# Altium project Reflex_InterfaceBoard_RevF_201603.PrjPcb
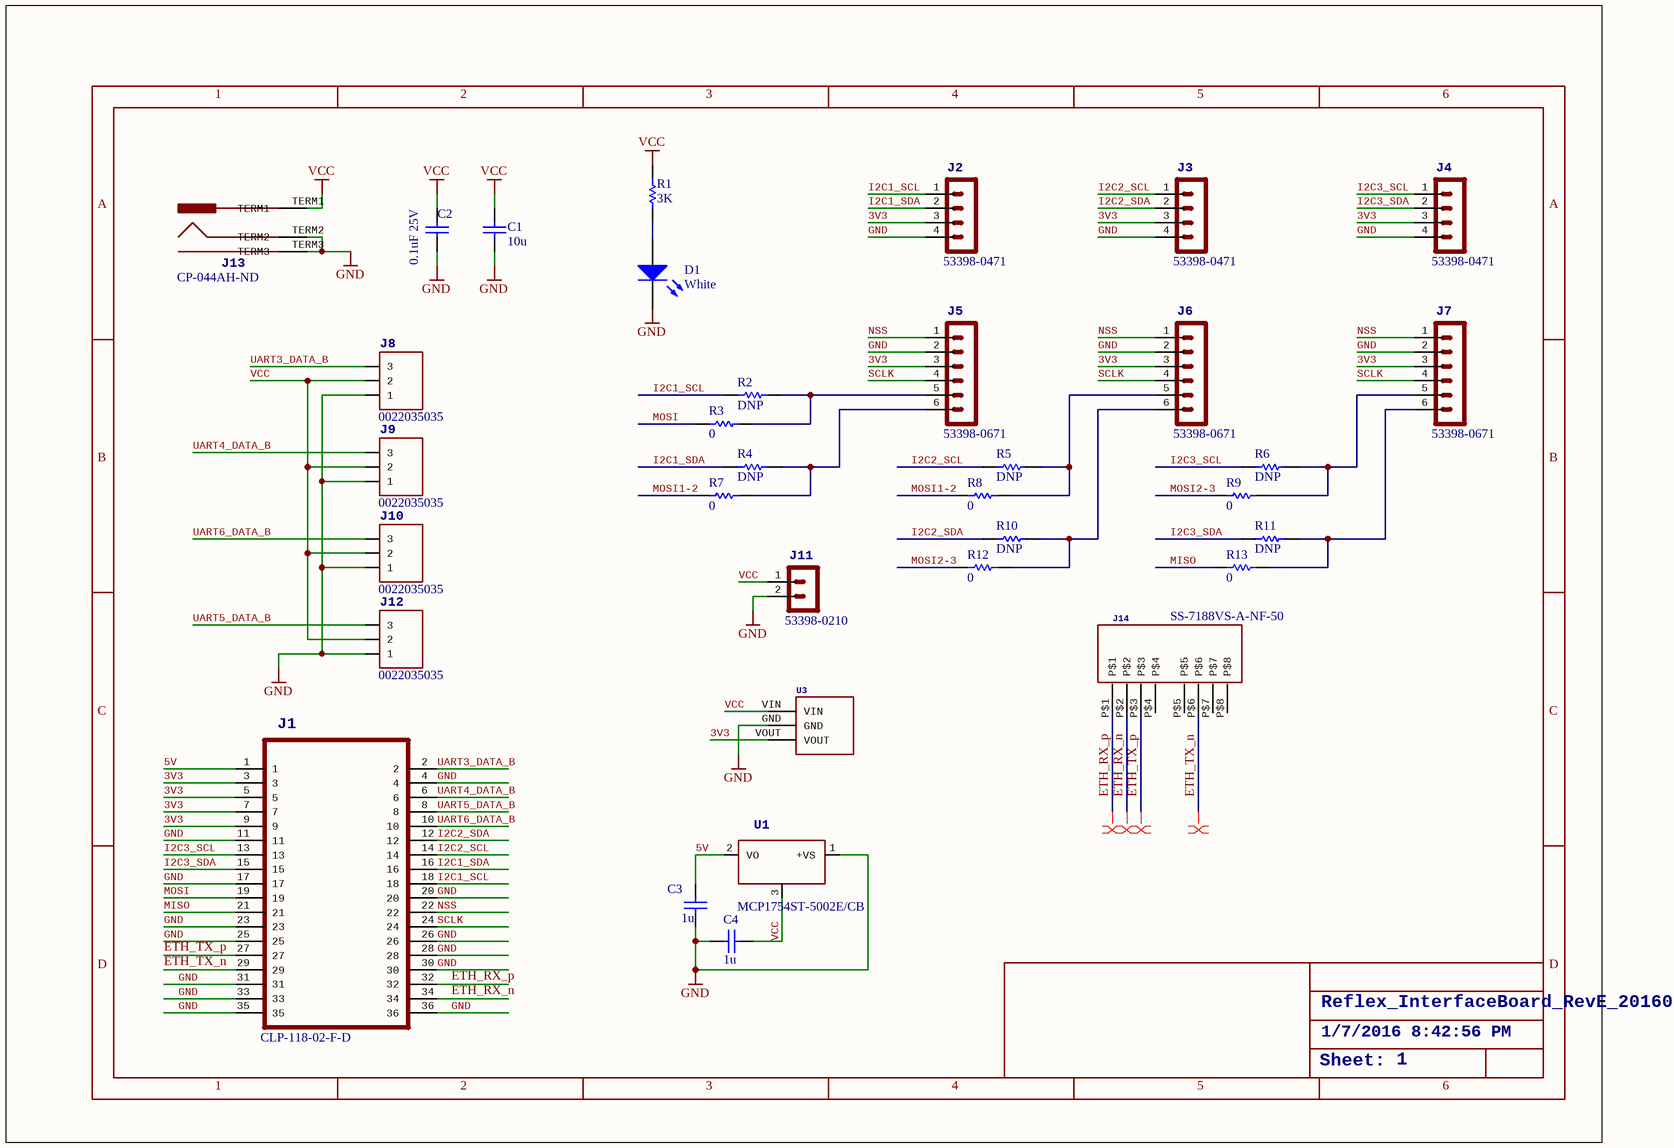
[diagram p0: Reflex_InterfaceBoard_RevF_201603.SchDoc]
1 sheet, 34 parts. Net scope: global (net labels, ports and power ports of the same name join across sheets).
Board files: Reflex_InterfaceBoard_RevF_201603.PcbDoc, ReflexInterfaceAndBrainRevF.PcbDoc

## Sheet Reflex_InterfaceBoard_RevF_201603.SchDoc: Reflex_InterfaceBoard_RevE_201601
size 282 x 200 mm; Date: 1/7/2016 8:42:56 PM; SheetNumber: 1

### Parts
C1  value 10u  [GENERIC_0603]  (hidden comment: Cap_0603_10uF)
C2  0.1uF 25V  [Generic_0603]
C3  1u  [Generic_0603]
C4  1u  [Generic_0603]
D1  value White  [0402_LED_WHITE]  (hidden comment: LED White)
J1  CLP-118-02-F-D  [SAMTEC_CLP-118-02-F-D]
J2  53398-0471  [53398-0410]
J3  53398-0471  [53398-0410]
J4  53398-0471  [53398-0410]
J5  53398-0671  [53398-0610]
J6  53398-0671  [53398-0610]
J7  53398-0671  [53398-0610]
J8  0022035035  [0022035035]
J9  0022035035  [0022035035]
J10  0022035035  [0022035035]
J11  53398-0210  [53398-0210]
J12  0022035035  [0022035035]
J13  value CP-044AH-ND  [BRLJCK(DK:CP-044AH-ND)]  (hidden comment: BRLJCK(DK:CP-044AH-ND))
J14  value SS-7188VS-A-NF-50  [STEWART-CONNECTOR-SS-7188VS-A-NF-50]
R1  3K  [Generic_0402]
R2  value DNP  [Generic_0402]  (hidden comment: Res_0402_DNP)
R3  value 0  [0402]  (hidden comment: Res_0402_0)
R4  value DNP  [Generic_0402]  (hidden comment: Res_0402_DNP)
R5  value DNP  [Generic_0402]  (hidden comment: Res_0402_DNP)
R6  value DNP  [Generic_0402]  (hidden comment: Res_0402_DNP)
R7  value 0  [0402]  (hidden comment: Res_0402_0)
R8  value 0  [0402]  (hidden comment: Res_0402_0)
R9  value 0  [0402]  (hidden comment: Res_0402_0)
R10  value DNP  [Generic_0402]  (hidden comment: Res_0402_DNP)
R11  value DNP  [Generic_0402]  (hidden comment: Res_0402_DNP)
R12  value 0  [0402]  (hidden comment: Res_0402_0)
R13  value 0  [0402]  (hidden comment: Res_0402_0)
U1  MCP1754ST-5002E/CB  [SOT-23]
U3  945-1394-5-ND(DIGIKEY)  [945-1394-5-ND(DIGIKEY)]  (value not drawn)

### Nets
GND: C1.1 C2.1 C3.1 C4.2 D1.2(K) J1.4 J1.11 J1.17 J1.20 J1.23 J1.25 J1.26 J1.28 J1.30 J1.31 J1.33 J1.35 J1.36 J2.4 J3.4 J4.4 J5.2 J6.2 J7.2 J8.3(1) J9.3(1) J10.3(1) J11.2 J12.3(1) J13.TERM2 J13.TERM3 U1.1(+VS) U3.GND
VCC: C1.2 C2.2 C4.1 J8.2 J9.2 J10.2 J11.1 J12.2 J13.TERM1 R1.2 U1.3(GND) U3.VIN
3V3: J1.3 J1.5 J1.7 J1.9 J2.3 J3.3 J4.3 J5.3 J6.3 J7.3 U3.VOUT
5V: C3.2 J1.1 U1.2(VO)
ETH_RX_n: J1.34 J14.P$2
ETH_RX_p: J1.32 J14.P$1
ETH_TX_n: J1.29 J14.P$6
ETH_TX_p: J1.27 J14.P$3
I2C1_SCL: J1.18 J2.1 R2.1
I2C1_SDA: J1.16 J2.2 R4.1
I2C2_SCL: J1.14 J3.1 R5.1
I2C2_SDA: J1.12 J3.2 R10.1
I2C3_SCL: J1.13 J4.1 R6.1
I2C3_SDA: J1.15 J4.2 R11.1
MISO: J1.21 R13.1
MOSI: J1.19 R3.1
MOSI1-2: R7.1 R8.1
MOSI2-3: R9.1 R12.1
NSS: J1.22 J5.1 J6.1 J7.1
SCLK: J1.24 J5.4 J6.4 J7.4
UART3_DATA_B: J1.2 J8.1(3)
UART4_DATA_B: J1.6 J9.1(3)
UART5_DATA_B: J1.8 J12.1(3)
UART6_DATA_B: J1.10 J10.1(3)
NetD1_1: D1.1(A) R1.1
NetJ5_5: J5.5 R2.2 R3.2
NetJ5_6: J5.6 R4.2 R7.2
NetJ6_5: J6.5 R5.2 R8.2
NetJ6_6: J6.6 R10.2 R12.2
NetJ7_5: J7.5 R6.2 R9.2
NetJ7_6: J7.6 R11.2 R13.2

Not connected (* = marked no-connect by the designer): J14 P$4 P$5 P$7 P$8

### Layout directives
differential pair: ETH_RX_n, ETH_RX_p, ETH_TX_n, ETH_TX_p

### Notes on the sheet
- Reflex_InterfaceBoard_RevE_201601
- Sheet:
- 1/7/2016 8:42:56 PM
- 1
- 2
- 3
- 4
- 5
- 6
- A
- B
- C
- D

### Library data of the parts
C1 = Cap_0603_10uF: Capacitor; Manufacturer: TDK Corporation; Manufacturer Part Number: C1608X5R1E106M080AC; Case-EIA: 0603; PackageReference: 0603; Mouser: 810-C1608X5R1E106M; Supplier 1: Digi-Key; Supplier 2: Mouser; Supplier Part Number 1: 445-9015-1-ND; Supplier Part Number 2: 810-C1608X5R1E106M
C2 = Cap_0603_0.1uF_25V: Capacitor 0.1uF 0603 package; Supplier 1: Digi-Key; Supplier Part Number 1: 478-1244-1-ND; Supplier Unit Price 1: 0.38; Supplier Unit Price 2: 0.13; Value: 0.1uF 25V
C3 C4 = Cap_0603_1uF: Capacitor; Supplier 1: Digi-Key; Supplier 2: Mouser; Supplier Part Number 1: 445-6931-1-ND; Supplier Part Number 2: 810-CGA3E1X7R1E105K; Value: 1u
D1 = LED_White_0402: Surface mount LEDs; Supplier 1: Digi-Key; Supplier Part Number 1: 511-1616-1-ND; Supplier Unit Price 1: 2.01; Supplier Unit Price 2: 0.66
J1 = CLP-118-02-F-D: SOCKET, 1.27MM, VERTICAL THT, 28WAY; Supplier 1: Digi-Key; Supplier 2: Arrow; Supplier Part Number 1: SAM1153-18-ND; Supplier Part Number 2: Hd5FWe5WamqVFNVzS9br4wkX5VAxLoW7P5aOAAr6WeM; Value: CLP-118-02-F-D
J2-J4 = 53398-0471: HEADER; Supplier 1: Digi-Key; Supplier 2: Mouser; Supplier Part Number 1: WM7608CT-ND; Supplier Part Number 2: 538-53398-0471; Value: 53398-0471
J5-J7 = 53398-0671: HEADER; Supplier 1: Digi-Key; Supplier 2: Mouser; Supplier Part Number 1: WM7610CT-ND; Supplier Part Number 2: 538-53398-0671; Value: 53398-0671
J8-J10 J12 = MOLEX_0022035035: CONN HEADER 3POS 2.5MM VERT TIN    Source:  http://www.digikey.com/product-detail/en/0022035035/WM18887-ND/403302 rfk_1850.pdf; Supplier 1: Digi-Key; Supplier 2: Arrow; Supplier Part Number 1: WM18887-ND; Supplier Part Number 2: F6SGQ1b0kgRjoMLxeC4aEYdS_OYU5CVqWNXtWKnXAEc; Value: 0022035035
J11 = 53398-0271: HEADER; Supplier 1: Digi-Key; Supplier 2: Mouser; Supplier Part Number 1: WM7606CT-ND; Supplier Part Number 2: 538-53398-0271; Value: 53398-0210
J14 = SS-7188VS-A-NF-50: Supplier Part Number 1: 380-1162-ND; Supplier 1: Digikey
R1 = Res_0402_3.0K: Resistor 3 Kohm; Supplier 1: Digi-Key; Supplier 2: Mouser; Supplier Part Number 1: P3.0KJCT-ND; Supplier Part Number 2: 667-ERJ-2GEJ302X; Value: 3K
R2 R4-R6 R10 R11 = Res_0402_DNP: Resistor 0402 DNP
R3 R7-R9 R12 R13 = Res_0402_0: Resistor 0 ohm; Supplier 1: Digi-Key; Supplier Part Number 1: P0.0JCT-ND; Supplier Unit Price 1: 0.05; Supplier Unit Price 2: 0.0048
U1 = LM50: SOT-23 Single-Supply Centigrade Temperature Sensor   Vout = (10mV/°C x Temp °C) +5mmmV Source: http://cache.national.com/ds/LM/LM50.pdf; Supplier 1: Digi-Key; Supplier Part Number 1: MCP1754ST-5002E/CBCT-ND; Supplier 2: Mouser; Supplier Part Number 2: 579-MCP1754T-5002ECB; Value: MCP1754ST-5002E/CB
J13 = BRLJCK(DK:CP-044AH-ND): Supplier Part Number 1: CP-044AH-ND; Supplier 1: Digikey
U3 = 945-1394-5-ND(DIGIKEY): Supplier Part Number 1: 945-1394-5-ND; Supplier 1: Digikey